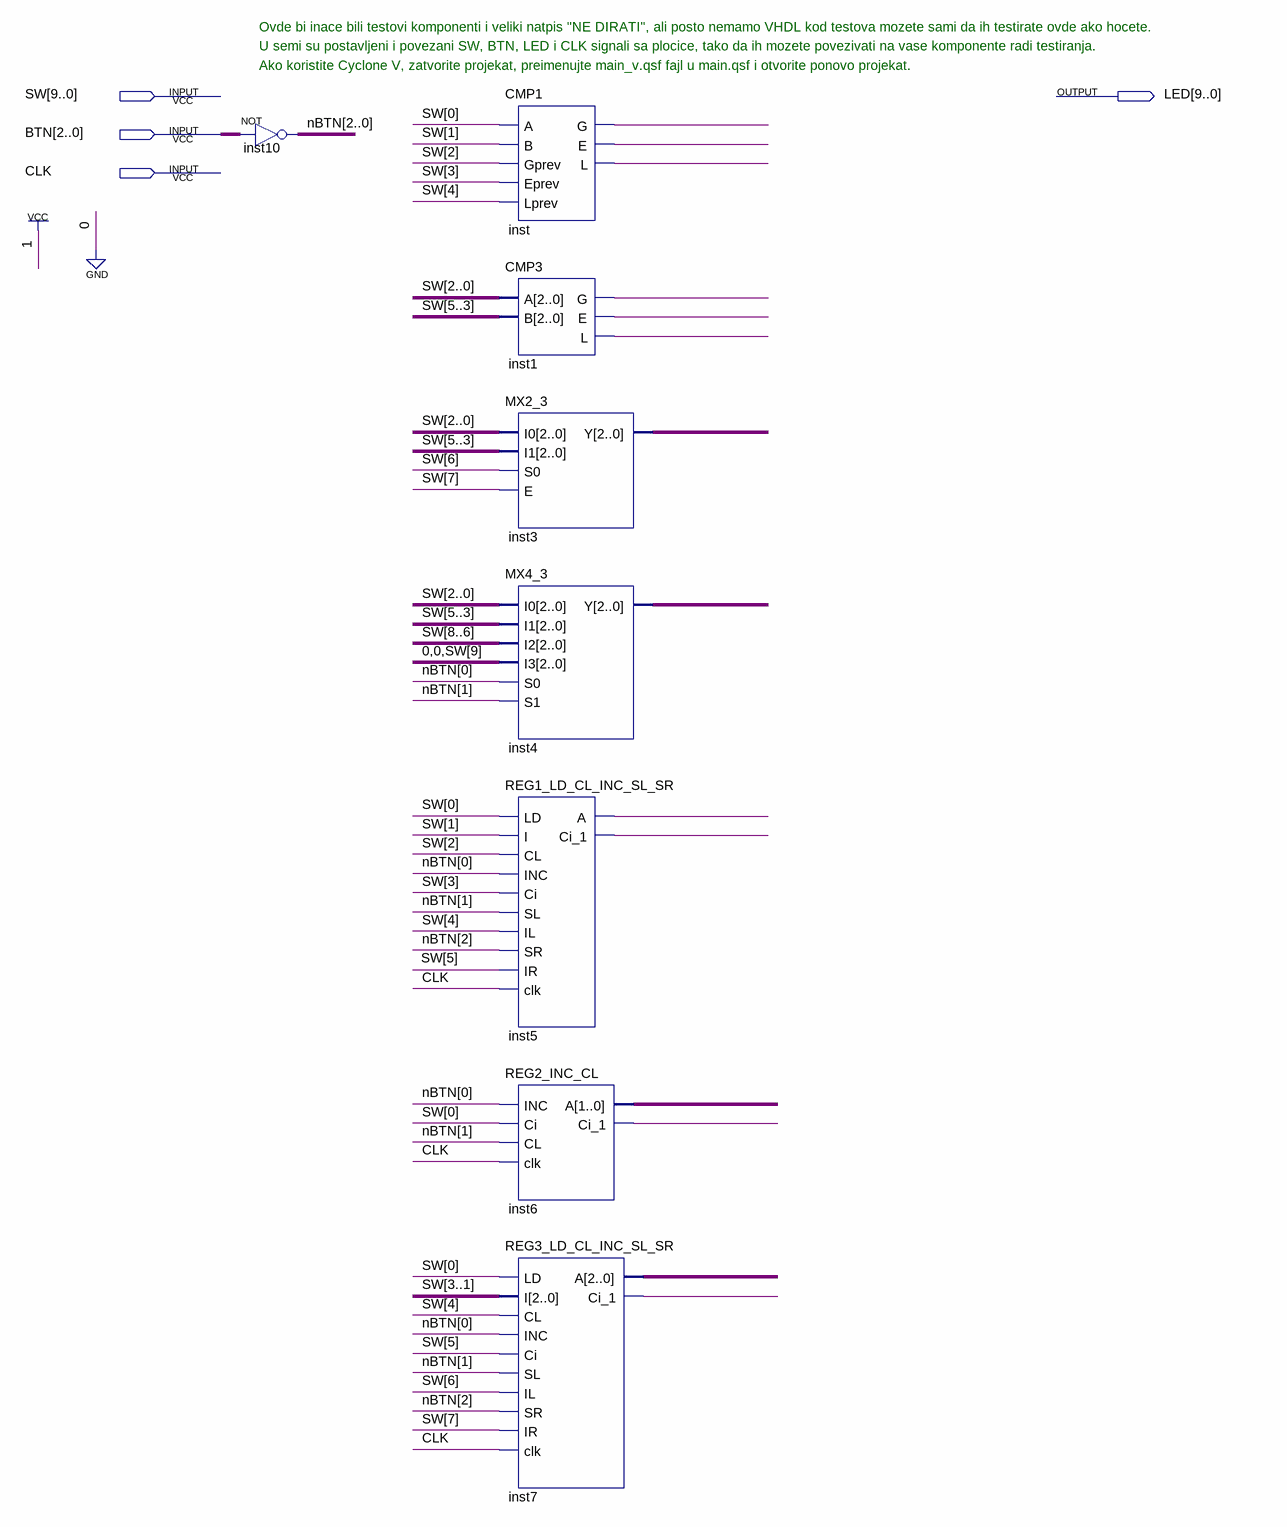
[diagram p0: schematic sheet]
// Quartus schematic main.bdf as structural Verilog: 8 symbols, 4 pins
module main (
  input  [9:0] SW,
  input  [2:0] BTN,
  input  CLK,
  output [9:0] LED
);

  wire inst1_e, inst1_g, inst1_l, inst5_a, inst5_ci_1, inst6_ci_1, inst7_ci_1, inst_e, inst_g, inst_l;
  wire [1:0] inst6_a;
  wire [2:0] inst3_y, inst4_y, inst7_a, nBTN;

  assign nBTN = ~BTN;  // NOT inst10, 3 bits wide
  CMP1 inst (.A(SW[0]), .B(SW[1]), .Gprev(SW[2]), .Eprev(SW[3]), .Lprev(SW[4]), .G(inst_g), .E(inst_e), .L(inst_l));
  CMP3 inst1 (.A(SW[2:0]), .B(SW[5:3]), .G(inst1_g), .E(inst1_e), .L(inst1_l));
  MX2_3 inst3 (.I0(SW[2:0]), .I1(SW[5:3]), .S0(SW[6]), .E(SW[7]), .Y(inst3_y));
  MX4_3 inst4 (.I0(SW[2:0]), .I1(SW[5:3]), .I2(SW[8:6]), .I3({2'b00, SW[9]}), .S0(nBTN[0]), .S1(nBTN[1]), .Y(inst4_y));
  REG1_LD_CL_INC_SL_SR inst5 (
    .LD(SW[0]), .I(SW[1]), .CL(SW[2]), .INC(nBTN[0]), .Ci(SW[3]), .SL(nBTN[1]), .IL(SW[4]), .SR(nBTN[2]),
    .IR(SW[5]), .clk(CLK), .A(inst5_a), .Ci_1(inst5_ci_1));
  REG2_INC_CL inst6 (.INC(nBTN[0]), .Ci(SW[0]), .CL(nBTN[1]), .clk(CLK), .A(inst6_a), .Ci_1(inst6_ci_1));
  REG3_LD_CL_INC_SL_SR inst7 (
    .LD(SW[0]), .I(SW[3:1]), .CL(SW[4]), .INC(nBTN[0]), .Ci(SW[5]), .SL(nBTN[1]), .IL(SW[6]), .SR(nBTN[2]),
    .IR(SW[7]), .clk(CLK), .A(inst7_a), .Ci_1(inst7_ci_1));

  // Notes on the sheet:
  //   Ovde bi inace bili testovi komponenti i veliki natpis "NE DIRATI", ali posto nemamo VHDL kod testova mozete sami da ih testirate ovde ako hocete.
  //   U semi su postavljeni i povezani SW, BTN, LED i CLK signali sa plocice, tako da ih mozete povezivati na vase komponente radi testiranja.
  //   Ako koristite Cyclone V, zatvorite projekat, preimenujte main_v.qsf fajl u main.qsf i otvorite ponovo projekat.
endmodule
